# Altium schematic sheet Project_Information.SchDoc: =project_title
size Tabloid; CompanyName: Luxonis Holding; Organization: Luxonis Holding; Address1: 1925 Harmony Park Drive; Address2: Westminster, CO; Address3: 80234; Address4: United States; SheetNumber: 1; SheetTotal: 17
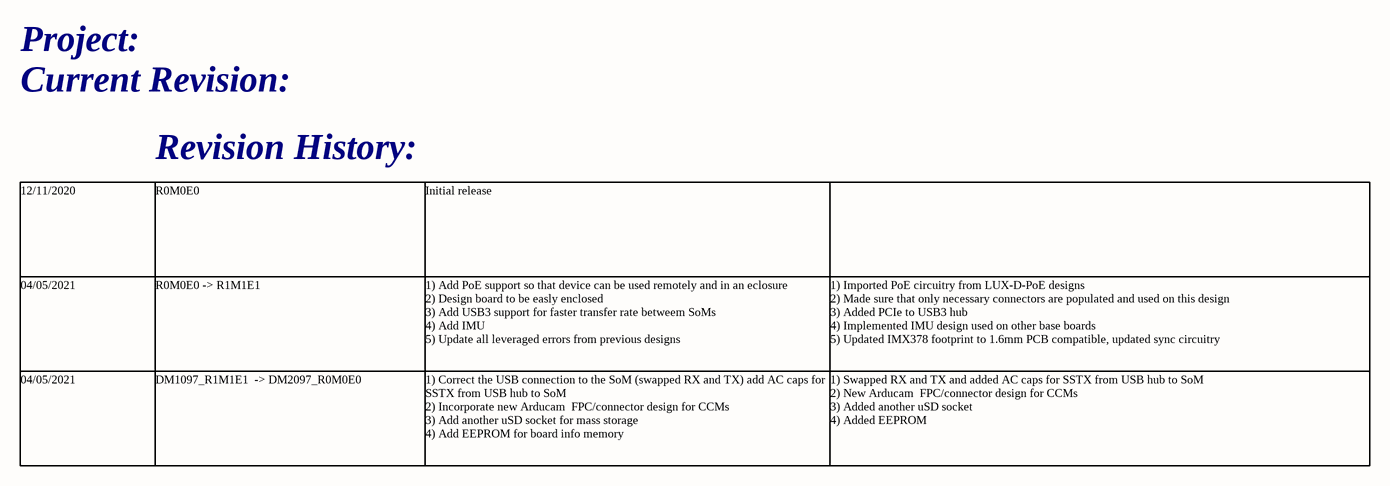
[diagram p0: Project_Information.SchDoc]

## Notes on the sheet
- Project:
- Current Revision:
- Revision History:
- 12/11/2020
- R0M0E0
- Initial release
- 04/05/2021
- R0M0E0 -> R1M1E1
- 1) Add PoE support so that device can be used remotely and in an eclosure
  2) Design board to be easly enclosed
  3) Add USB3 support for faster transfer rate betweem SoMs
  4) Add IMU
  5) Update all leveraged errors from previous designs
- 1) Imported PoE circuitry from LUX-D-PoE designs
  2) Made sure that only necessary connectors are populated and used on this design
  3) Added PCIe to USB3 hub
  4) Implemented IMU design used on other base boards
  5) Updated IMX378 footprint to 1.6mm PCB compatible, updated sync circuitry
- DM1097_R1M1E1  -> DM2097_R0M0E0
- 1) Correct the USB connection to the SoM (swapped RX and TX) add AC caps for SSTX from USB hub to SoM
  2) Incorporate new Arducam  FPC/connector design for CCMs
  3) Add another uSD socket for mass storage
  4) Add EEPROM for board info memory
- 1) Swapped RX and TX and added AC caps for SSTX from USB hub to SoM
  2) New Arducam  FPC/connector design for CCMs
  3) Added another uSD socket
  4) Added EEPROM
- Title
- Size:
- Date:
- Tabloid
- Number:
- Time:
- Revision:
- Sheet
- of
- Drawn by: